# Altium schematic sheet CONNECTORS_SELECTORS.SchDoc
size A3; SheetNumber: 8; SheetTotal: 14
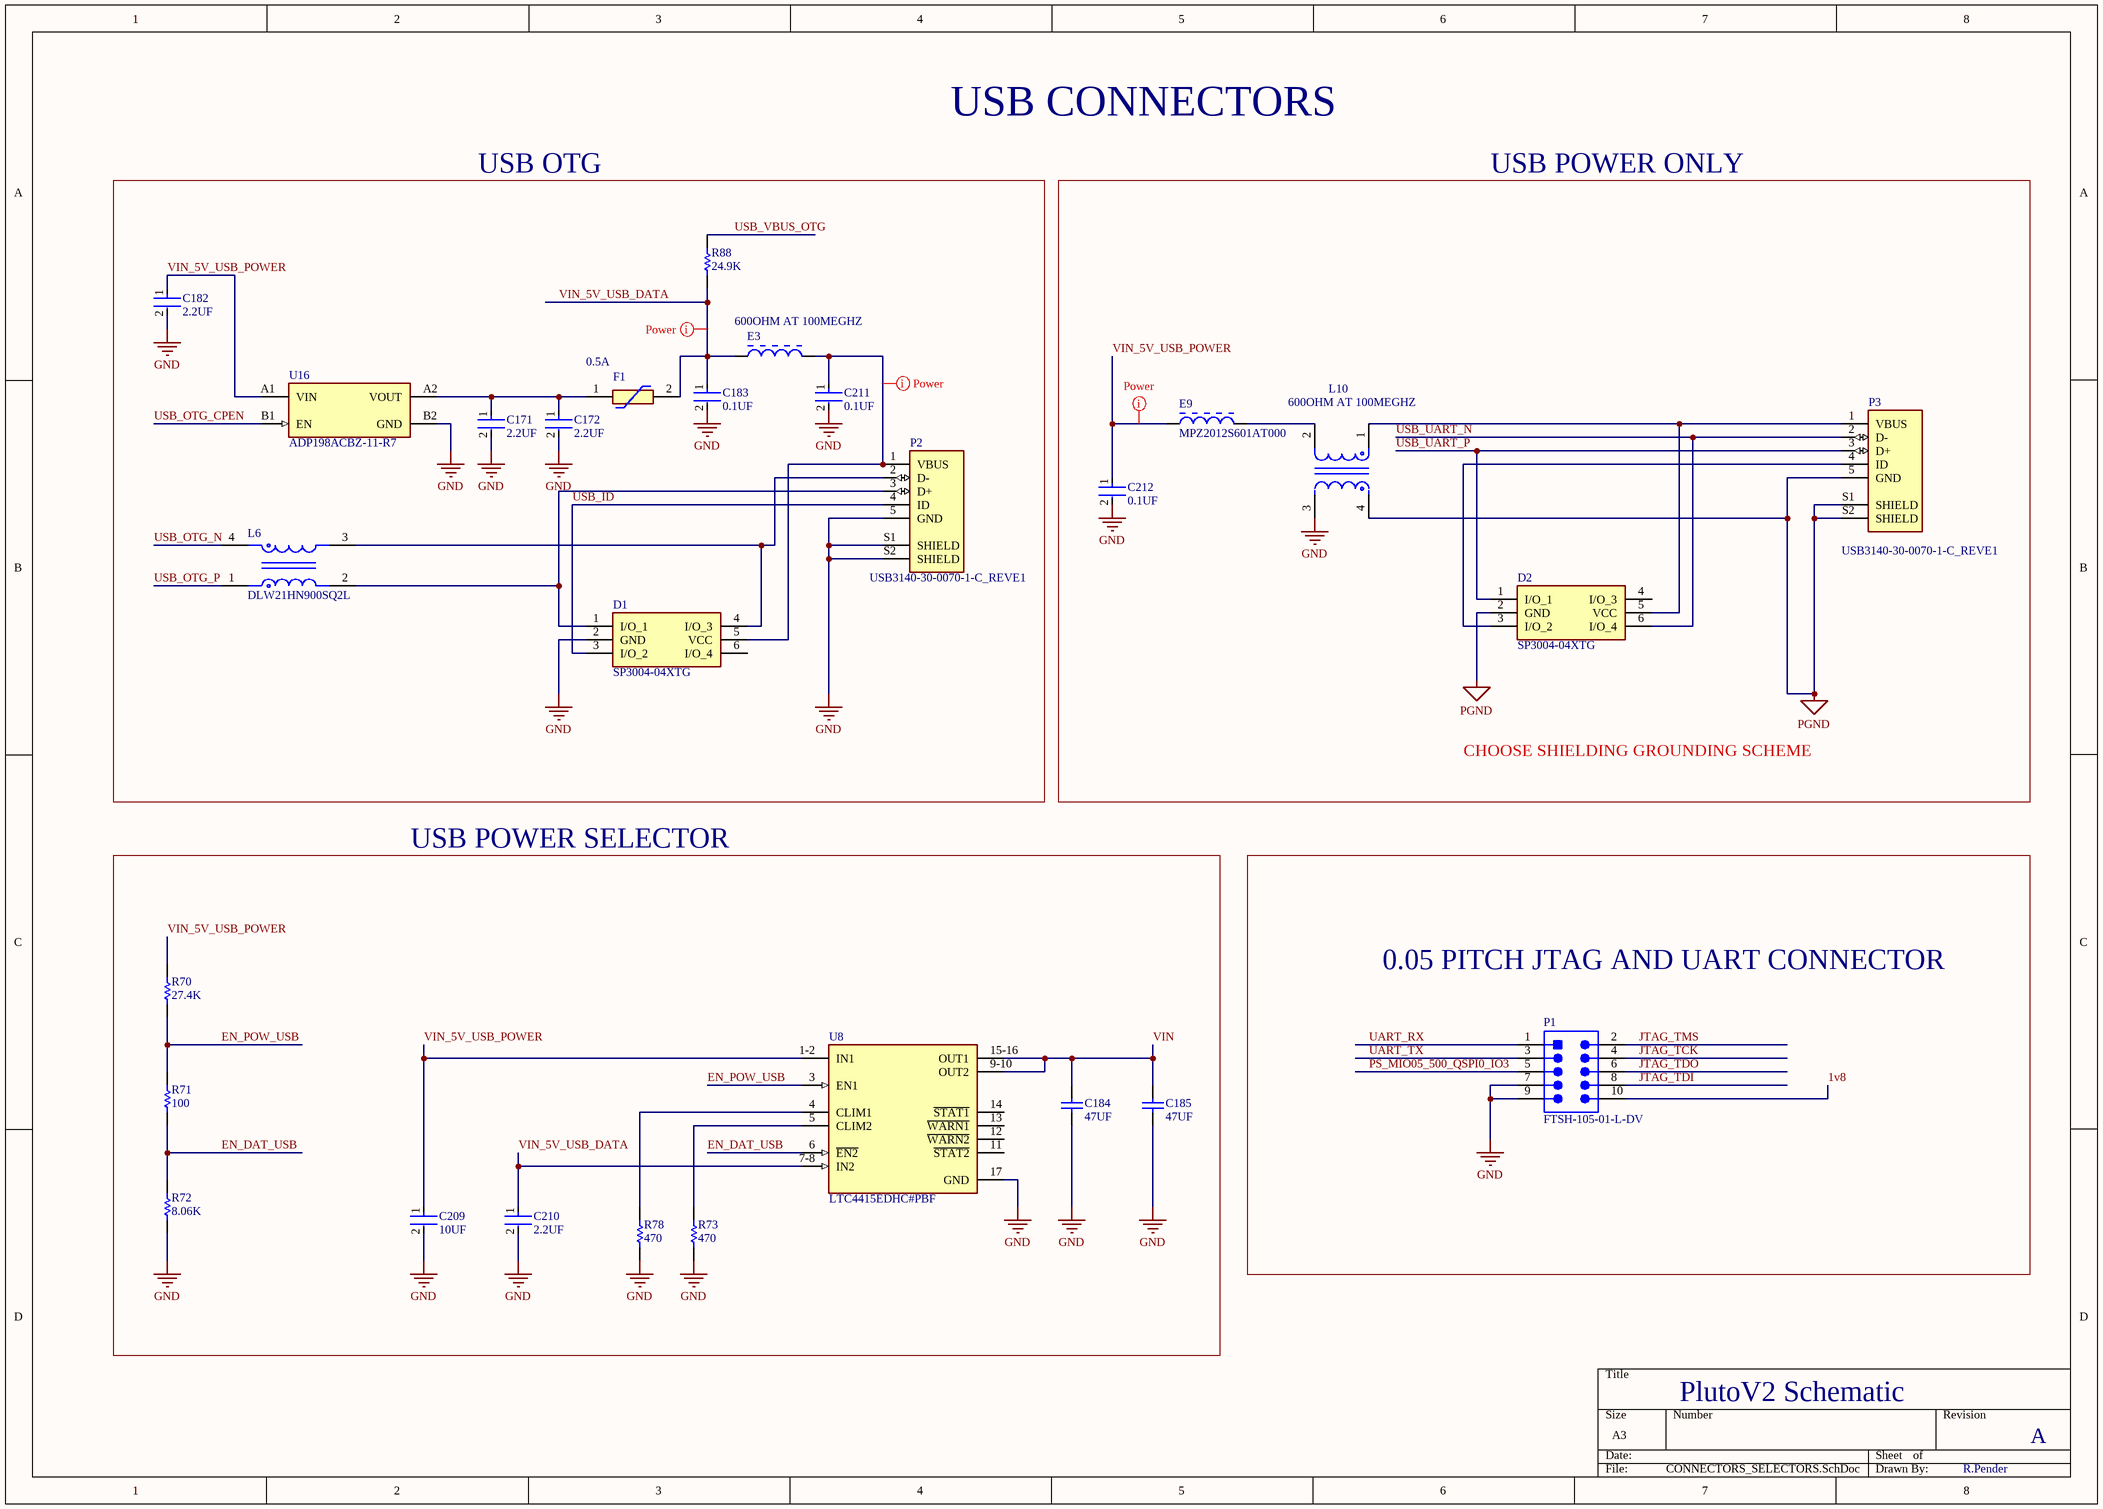
[diagram p0: CONNECTORS_SELECTORS.SchDoc]

## Parts
C171  2.2UF  [FP-GRM188-0_2-IPC_C]
C172  2.2UF  [FP-GRM188-0_2-IPC_C]
C182  2.2UF  [FP-GRM188-0_2-IPC_C]
C183  0.1UF  [FP-CL10-IPC_A]
C184  47UF  [TAYO-JMK212BBJ476MG-T_L]
C185  47UF  [TAYO-JMK212BBJ476MG-T_L]
C209  10UF  [FP-GRM188-0_15-MFG]
C210  2.2UF  [FP-GRM188-0_2-IPC_C]
C211  0.1UF  [FP-CL10-IPC_A]
C212  0.1UF  [FP-CL10-IPC_A]
D1  SP3004-04XTG  [SOTFL50P160X60-6N]
D2  SP3004-04XTG  [SOTFL50P160X60-6N]
E3  600OHM AT 100MEGHZ  [TDK-MPZ2012_V]
E9  MPZ2012S601AT000  [TDK-MPZ2012_V]
F1  0.5A  [0402L010SLKR]
L6  DLW21HN900SQ2L  [FP-DLW21HN-MFG]
L10  600OHM AT 100MEGHZ  [FP-DLW5BS-MFG]
P1  FTSH-105-01-L-DV  [SMTC-FTSH-105-01-L-DV_V]
P2  USB3140-30-0070-1-C_REVE1  [GCT_USB3140-30-0070-1-C_REVE1]
P3  USB3140-30-0070-1-C_REVE1  [GCT_USB3140-30-0070-1-C_REVE1]
R70  27.4K  [2-0402]
R71  100  [2-0402]
R72  8.06K  [2-0402]
R73  470  [RESC1005X40X25ML05T10]
R78  470  [RESC1005X40X25ML05T10]
R88  24.9K  [2-0402]
U8  LTC4415EDHC#PBF  [FP-DHC-16-05-08-1872-MFG]
U16  ADP198ACBZ-11-R7  [FP-CB-4-4-MFG]

## Blocks framed on the sheet
USB OTG: C171 C172 C182 C183 C211 D1 E3 F1 L6 P2 R88 U16
USB POWER ONLY: C212 D2 E9 L10 P3
USB POWER SELECTOR: C184 C185 C209 C210 R70-R73 R78 U8
0.05 PITCH JTAG AND UART CONNECTOR: P1

## Nets
GND: C171.2 C172.2 C182.2 C183.2 C184.2 C185.2 C209.2 C210.2 C211.2 C212.2 D1.2(GND) L10.3 P1.7 P1.9 P2.5(GND) P2.S1(SHIELD) P2.S2(SHIELD) R72.2 R73.2 R78.2 U8.17(GND) U16.B2(GND)
PGND: D2.2(GND) L10.4 P3.5(GND) P3.S1(SHIELD) P3.S2(SHIELD)
1v8: P1.10
EN_DAT_USB: R71.2 R72.1 U8.6(~{EN2})
EN_POW_USB: R70.2 R71.1 U8.3(EN1)
JTAG_TCK: P1.4
JTAG_TDI: P1.8
JTAG_TDO: P1.6
JTAG_TMS: P1.2
PS_MIO05_500_QSPI0_IO3: P1.5
UART_RX: P1.1
UART_TX: P1.3
USB_ID: D1.3(I/O_2) P2.4(ID)
USB_OTG_CPEN: U16.B1(EN)
USB_OTG_N: L6.4
USB_OTG_P: L6.1
USB_UART_N: D2.6(I/O_4) P3.2(D-)
USB_UART_P: D2.1(I/O_1) P3.3(D+)
USB_VBUS_OTG: R88.2
VIN: C184.1 C185.1 U8.9-10(OUT2) U8.15-16(OUT1)
VIN_5V_USB_DATA: C183.1 C210.1 E3.1 F1.2 R88.1 U8.7-8(IN2)
VIN_5V_USB_POWER: C182.1 C209.1 C212.1 E9.1 R70.1 U8.1-2(IN1) U16.A1(VIN)
NetC171_1: C171.1 C172.1 F1.1 U16.A2(VOUT)
NetC211_1: C211.1 D1.5(VCC) E3.2 P2.1(VBUS)
NetD1_1: D1.1(I/O_1) L6.2 P2.3(D+)
NetD1_4: D1.4(I/O_3) L6.3 P2.2(D-)
NetD2_3: D2.3(I/O_2) P3.4(ID)
NetD2_5: D2.5(VCC) L10.1 P3.1(VBUS)
NetE9_2: E9.2 L10.2
NetR73_1: R73.1 U8.5(CLIM2)
NetR78_1: R78.1 U8.4(CLIM1)

Not connected (* = marked no-connect by the designer): D1 6(I/O_4); D2 4(I/O_3); U8 11(~{STAT2}) 12(~{WARN2}) 13(~{WARN1}) 14(~{STAT1})

## Layout directives
net class Power: NetC211_1, VIN_5V_USB_DATA, VIN_5V_USB_POWER

## Notes on the sheet
- USB CONNECTORS
- CHOOSE SHIELDING GROUNDING SCHEME
- PlutoV2 Schematic
- A
- R.Pender

## Library data of the parts
C171 C172 C182 C210 = CMP-06035-023692-1: Chip Multilayer Ceramic Capacitors for General Purpose, 0603, 2.2uF, X5R, 15%, 10%, 50V; Mount: Surface Mount; Case/Package: 0603; Voltage Rating (DC): 50V; Weight: 0.000222oz; Capacitance: 2.2uF; Max Operating Temperature: 85°C; Length: 0.063inch; Thickness: 0.039inch; Dielectric: X5R; Min Operating Temperature: -55°C; Termination: SMD/SMT; Resistor Type: Ceramic; Width: 0.8mm; Voltage Rating: 50V; Height: 0.8mm; Tolerance: 10%; Case Code (Metric): 1608; Package Quantity: 10000; Packaging: Tape and Reel; Case Code (Imperial): 0603
C183 C211 C212 = CMP-13271-004036-1: Cap Ceramic 100nF 100V X7R ±10% Pad SMD 0603 +125°C T/R; Mount: Surface Mount; Packaging: Cut Tape; Width: 0.031inch; Thickness: 0.035inch; Length: 0.063inch; Tolerance: 10%; Min Operating Temperature: -55°C; Case/Package: 0603; Voltage Rating: 100V; Max Operating Temperature: 125°C; Case Code (Metric): 1608; Capacitance: 100nF; Case Code (Imperial): 0603
C184 C185 = CMP-2000-06498-1: High Value Multilayer Ceramic Capacitor, 47 uF, +/-20%, 6.3 V, -55 to 85 degC, 2-Pin SMD (0805), RoHS, Tape and Reel; Manufacturer: Taiyo Yuden; PCN Part Number: X5R,X7RDielectrics23/Jan/2008; Kits: 587-1797-KIT-ND-KITCAPCERHICAP0603&0805S; Temperature Coefficient: X5R; Tolerance: ±20%; Online Catalog: MSeries; Other Names: 587-1779-1; Capacitance: 47µF; Voltage - Rated: 6.3V; Catalog Drawings: xMKSeries_0805_1.25; Operating Temperature: -55°C~85°C; Mounting Technology: SurfaceMount; Package Reference: 0805; Features: -; Lead Spacing: -; Lead Style: -; Family: CeramicCapacitors; Size / Dimension: 0.079"Lx0.049"W(2.00mmx1.25mm); Package Description: 2-Pin SMD, Body 2.2 x 1.45 mm; Mounting Type: SurfaceMount,MLCC; Package / Case: 0805(2012Metric); Series: M; Category: Capacitors; Packaging: CutTape(CT); Datasheet Version: 10/2015; Datasheet URL: http://datasheet.octopart.com/JMK212BJ476MG-T-Taiyo-Yuden-datasheet-62109412.pdf; Manufacturer URL: http://www.t-yuden.com/; Ratings: -; Height - Seated (Max): -; Standard Package: 1; Thickness (Max): 0.053"(1.35mm); Applications: GeneralPurpose
C209 = CMP-06035-003612-1: Chip Multilayer Ceramic Capacitors for General Purpose, 0603, 10uF, X5R, 15%, 20%, 10V; Tolerance: 20%; Dielectric: X5R; Package Quantity: 4000; Width: 0.8mm; Case/Package: 0603; Thickness: 0.035inch; Capacitance: 10uF; Voltage Rating: 10V; Voltage Rating (DC): 10V; Termination: SMD/SMT; Length: 1.6mm; Lead Free: Lead Free; Mount: Surface Mount; Height: 0.8mm; Depth: 0.8mm; Packaging: Tape and Reel; Weight: 0.000222oz; Min Operating Temperature: -55°C; Case Code (Metric): 1608; Max Operating Temperature: 85°C; Case Code (Imperial): 0603; Material: Ceramic
D1 D2 = SP3004-04XTG: TVS Diode (Uni-directional); Manufacturer_Name: LITTELFUSE; Datasheet Link: https://m.littelfuse.com/~/media/electronics/datasheets/tvs_diode_arrays/littelfuse_tvs_diode_array_sp3004_datasheet.pdf.pdf; Height: 0.6mm; Manufacturer_Part_Number: SP3004-04XTG
E3 E9 = CMP-2000-05401-1: Chip Bead, 0.1 Ohm, 2 A, -55 to 125 degC, 2-Pin SMD (0805), RoHS, Tape and Reel; PCN Part Number: MMZ,MPSSeriesOct/2014; Manufacturer: TDK; Impedance @ Frequency: 600Ohm@100MHz; Other Names: 445-2206-6; Catalog Drawings: (MMZ,MPZ)2012SeriesTop / (MMZ,MPZ)2012SeriesFootprint / (MMZ,MPZ)2012SeriesSide; DC Resistance (DCR): 100mOhmMax; Current Rating: 2A; Product Training Modules: EMCComponents; Filter Type: DifferentialMode-Single; Online Catalog: MPZ2012Series; Datasheet URL: http://datasheet.octopart.com/MPZ2012S601AT000-TDK-datasheet-12512619.pdf; Size / Dimension: 0.079"Lx0.049"W(2.00mmx1.25mm); Package Reference: 805; Package / Case: 0805(2012Metric); Packaging: Digi-Reel; Mounting Type: SurfaceMount; Family: FerriteBeadsandChips; Category: Filters; Height (Max): 0.041"(1.05mm); Datasheet Version: Sep-12; Manufacturer URL: http://www.tdk.com/; Series: MPZ; Package Description: 2-Pin Surface Mount Device, Body 2 x 1.25 mm; Standard Package: 1
F1 = 0402L050SLKR: Resettable Fuse; Manufacturer_Name: LITTELFUSE; Datasheet Link: https://g.componentsearchengine.com/Datasheets/1/0402L010SLKR.pdf; Height: 0.6mm; Manufacturer_Part_Number: 0402L050SLKR
L6 = CMP-06045-000050-1: CMC 330MA 2LN 90 OHM SMD; Tolerance: 25%; Frequency: 100MHz; Shielding: Unshielded; Impedance: 90R; Number of Lines: 2; DC Resistance (DCR): 350mR; Voltage Rating: 50V; DC Current: 330mA; Current Rating: 330mA; Lead Free: Lead Free; Length: 2mm; Radiation Hardening: No; Max Operating Temperature: 85°C; Depth: 1.2mm; Weight: 0.000317oz; Height: 0.9mm; Termination: SMD/SMT; Min Operating Temperature: -40°C; Case/Package: 0805; Packaging: Tape and Reel; Width: 0.047inch; Test Frequency: 100MHz; Mount: Surface Mount; Current: 330mA; Military Standard: Not; Package Quantity: 1; Resistor Type: Wirewound; Case Code (Imperial): 0805; Max DC Current: 330mA
L10 = CMP-06045-000287-1: Common Mode Choke, 2020, 800Ω @ 100MHz, 0.056Ω, 40%, 2A; Number of Lines: 2; Impedance: 800R; DC Resistance (DCR): 56mR; Voltage Rating (DC): 50V; Tolerance: 40%; Package Quantity: 400; Max Current Rating: 2A; Termination: Wire; Max Operating Temperature: 105°C; Height: 0.197inch; Width: 5mm; Mount: Surface Mount; Case/Package: 2020; Weight: 0.010582oz; Length: 5mm; Max DC Current: 2A; Min Operating Temperature: -40°C; Packaging: Tape and Reel
P1 = CMP-2000-05354-1: Male Header, Pitch 1.27 mm, 2 x 5 Position, Height 5.96 mm, -55 to 125 degC, RoHS, Bulk; Manufacturer: Samtec; Connector Type: Header,Unshrouded; Pitch: 0.050"(1.27mm); Mating Products: FLE-105-01-G-DV-TR-ND-CONNSKT1.27MM10POSDUALSMDCLP-105-02-G-D-P-TR-ND-CONNRCPT10POSDUAL.05"SMDSFMC-105-L2-S-D-TR-ND-CONN.05"SURFACE10POSSMTSFMH-105-02-L-D-TR-ND-CONNRECEPT10POS.50"SMTFLE-105-01-G-DV-A-ND-CONNSKT1.27MM10POSDUALSMDCLP-105-02-G-D-BE-ND-CONNRCPT10POSDUAL.05"SMDFLE-105-01-G-DV-A-P-ND-CONNSKT1.27MM10POSDUALSMDSAM1153-05-ND-CONNRCPT10POSDUAL.05"SMDSAM1155-05-ND-CONNRCPT10POSDUAL.05"SMDSAM1154-05-ND-CONNRCPT10POSDUAL.05"SMDSFMH-105-02-L-D-LC-ND-CONNRECEPT10POS.50"SMTSAM1226-05-ND-CONNRCPT.05"10POSDUALSMD; Catalog Drawings: FTSHSeriesFTSHSeriesSMTSide; Other Names: SAM1161-05; EDA / CAD Models: DownloadfromAcceleratedDesigns; Number of Positions Loaded: All; Number of Positions: 10; Featured Product: Board-To-BoardInterconnectSystems; Online Catalog: FTSHSeries; Product Training Modules: Board-to-BoardConnectors; Category: Connectors,Interconnects; Number of Rows: 2; Contact Finish: Gold; Termination: Solder; Mounting Type: SurfaceMount; Series: FTSH; Contact Mating Length: 0.120"(3.05mm); Row Spacing: 0.050"(1.27mm); Datasheet URL: https://datasheet.ciiva.com/30493/0900766b80adfe36-30493006.pdf; Contact Finish Thickness: 10µin(0.25µm); Features: -; Standard Package: 1; Packaging: Bulk; Datasheet Version: Feb-08; Manufacturer URL: http://www.samtec.com/; Fastening Type: -; Family: RectangularConnectors-Headers,MalePins; Contact Type: MalePin; Color: Black
P2 P3 = USB3140-30-0070-1-C_REVE1: USB-micro B Ñ€Ð°Ð·ÑŠÐµÐ¼ Ñ€Ð¾Ð·ÐµÑ‚ÐºÐ¸ USB 2.0 5-Ð¿Ð¾Ð·Ð¸Ñ†Ð¸Ð¾Ð½Ð½Ð¾Ðµ Ð¿Ð¾Ð²ÐµÑ€Ñ…Ð½Ð¾ÑÑ‚Ð½Ð¾Ðµ ÐºÑ€ÐµÐ¿Ð»ÐµÐ½Ð¸Ðµ, ÑÐºÐ²Ð¾Ð·Ð½Ð¾Ðµ Ð¾Ñ‚Ð²ÐµÑ€ÑÑ‚Ð¸Ðµ; MF: Global Connector Technology; SnapEDA_Link: https://www.snapeda.com/parts/USB3140-30-0070-1-C/Global%20Connector%20Technology/view-part/697013/?ref=snap; Availability: Warning; Price: None; Package: None; Check_prices: https://www.snapeda.com/parts/USB3140-30-0070-1-C/Global%20Connector%20Technology/view-part/697013/?ref=eda; Purchase-URL: https://pricing.snapeda.com/search/part/USB3140-30-0070-1-C/?ref=eda; Value: *; MP: USB3140-30-0070-1-C
R70-R72 R88 = ERJ2RK: Precision Thick Film Chip Resistor, 10 Ohm to 1M Ohm Range, 1% and 0.5% Tolerance, 0402 Size, 0.063 W; Published: 17-Dec-2003; LatestRevisionDate: 19-Mar-2004; LatestRevisionNote: Silkscreen size reduced.; PackageDocument: Mar-2003; PackageReference: 2-0402; Publisher: Altium Limited; Code_IPC: 1005 [0402]; ComponentLink1Description: Manufacturer Link; ComponentLink1URL: http://www.panasonic.com/industrial/components/resistive_products.htm; ComponentLink2Description: Datasheet; ComponentLink2URL: http://www.panasonic.com/industrial/components/pdf/AOA0000CE2.pdf
R73 R78 = CMP-2002-07697-1: Part Number: RC0402FR-07470RL; Manufacturer: Yageo / Phycomp
U8 = CMP-0479-00072-2: IC OR CTRLR SRC SELECT 16DFN; Max Output Current: 4A; Operating Supply Current: 44uA; Packaging: Rail/Tube; Max Operating Temperature: 125°C; Min Operating Temperature: -40°C; Number of Pins: 16; Length: 5mm; Package Quantity: 73; Radiation Hardening: No; Series: PowerPath™; RoHS Compliant: Yes; Case/Package: DFN EP; Lead Free: Lead Free
U16 = CMP-09134-000005-1: IC PWR SWITCH P-CHAN 1:1 4WLCSP; Output Configuration: High Side; On-State Resistance: 40mR; Max Input Voltage: 6.5V; Fault Protection: Reverse Current; Min Input Voltage: 1.65V; Output Current per Channel: 1A; Interface: On/Off; Number of Outputs: 1; Operating Supply Current: 1.1uA; Min Operating Temperature: -40°C; Mount: Surface Mount; Lead Free: Contains Lead; Packaging: Tape and Reel; Max Operating Temperature: 85°C; Package Quantity: 3000; RoHS Compliant: Yes; Operating Supply Voltage: 6.5V; Series: -; Output Current: 1A; Number of Pins: 4; Max Output Current: 1A